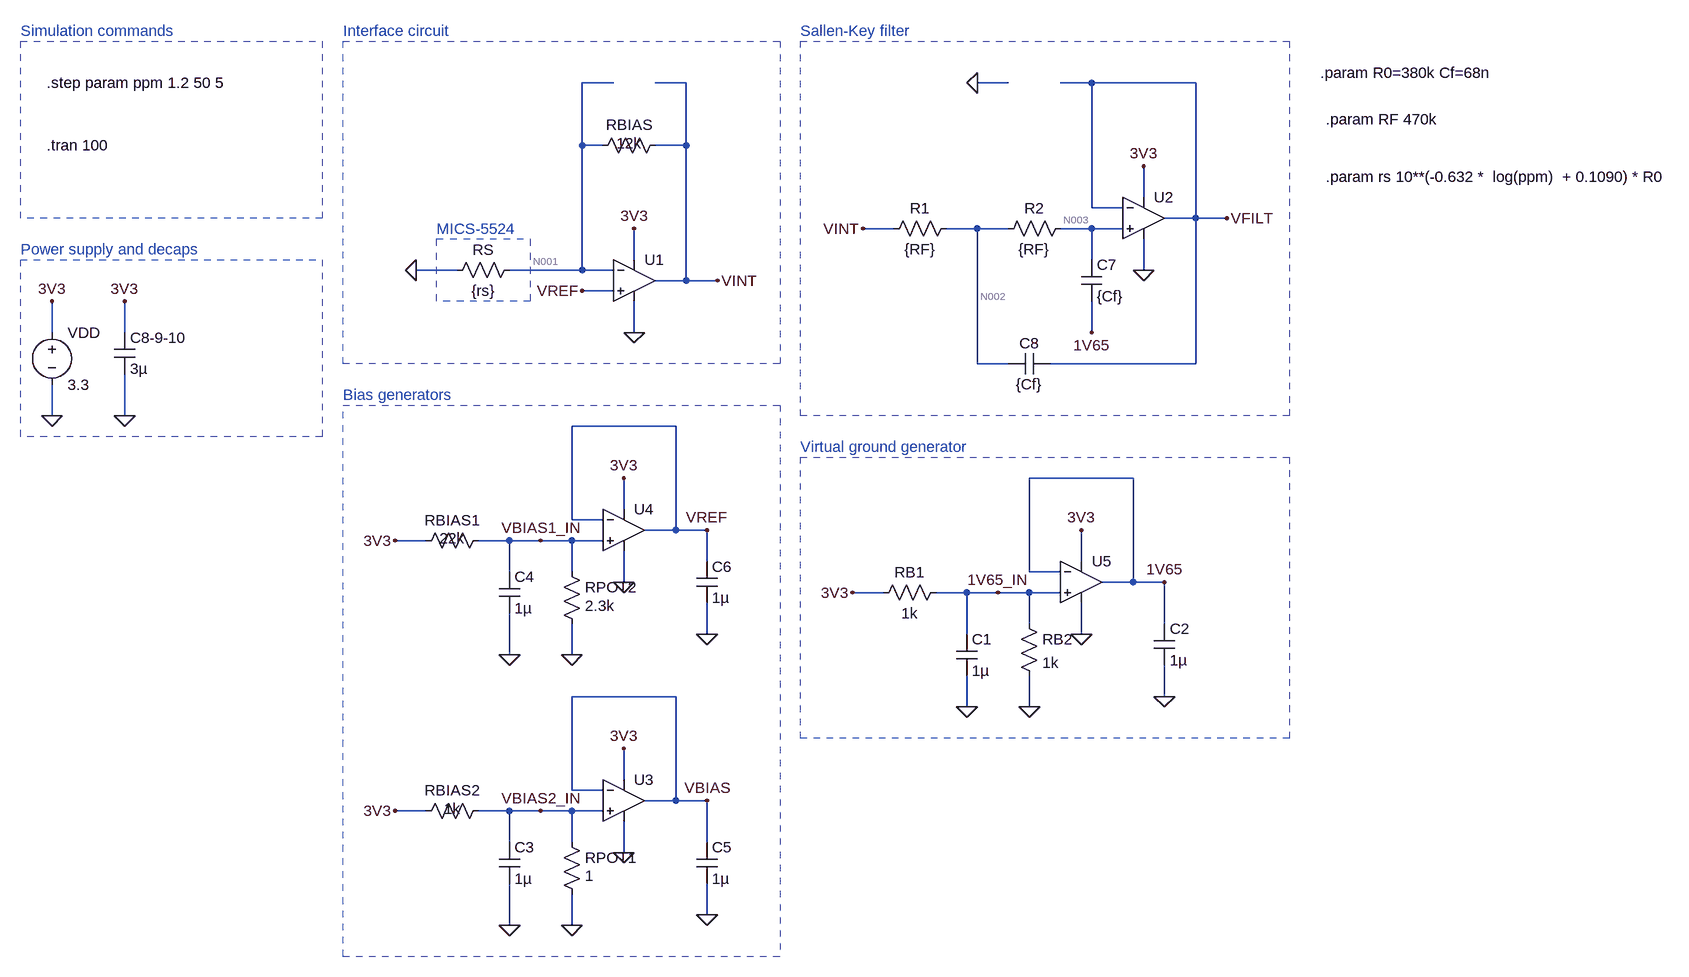
[diagram p0: schematic conditioning_chain_student.asc]
conditioning_chain_student.asc, the LTspice schematic file:
Version 4
SHEET 1 1052 1636
WIRE -832 -176 -880 -176
WIRE -720 -176 -768 -176
WIRE -224 -176 -272 -176
WIRE -96 -176 -144 -176
WIRE 64 -176 -96 -176
WIRE -880 -80 -880 -176
WIRE -848 -80 -880 -80
WIRE -720 -80 -720 -176
WIRE -720 -80 -768 -80
WIRE -16 0 -16 -48
WIRE -96 16 -96 -176
WIRE -48 16 -96 16
WIRE 64 32 64 -176
WIRE 64 32 16 32
WIRE 112 32 64 32
WIRE -400 48 -448 48
WIRE -272 48 -320 48
WIRE -224 48 -272 48
WIRE -96 48 -144 48
WIRE -48 48 -96 48
WIRE -800 96 -800 48
WIRE -96 96 -96 48
WIRE -1072 112 -1136 112
WIRE -880 112 -880 -80
WIRE -880 112 -992 112
WIRE -832 112 -880 112
WIRE -16 112 -16 64
WIRE -720 128 -720 -80
WIRE -720 128 -768 128
WIRE -672 128 -720 128
WIRE -832 144 -880 144
WIRE -1696 208 -1696 160
WIRE -1584 208 -1584 160
WIRE -800 208 -800 160
WIRE -96 208 -96 160
WIRE -272 256 -272 48
WIRE -224 256 -272 256
WIRE 64 256 64 32
WIRE 64 256 -160 256
WIRE -1696 336 -1696 288
WIRE -1584 336 -1584 272
WIRE -736 352 -896 352
WIRE -32 432 -192 432
WIRE -816 480 -816 432
WIRE -896 496 -896 352
WIRE -848 496 -896 496
WIRE -736 512 -736 352
WIRE -736 512 -784 512
WIRE -688 512 -736 512
WIRE -1120 528 -1168 528
WIRE -992 528 -1040 528
WIRE -944 528 -992 528
WIRE -896 528 -944 528
WIRE -848 528 -896 528
WIRE -688 560 -688 512
WIRE -112 560 -112 512
WIRE -992 576 -992 528
WIRE -896 576 -896 528
WIRE -192 576 -192 432
WIRE -144 576 -192 576
WIRE -816 592 -816 544
WIRE -32 592 -32 432
WIRE -32 592 -80 592
WIRE 16 592 -32 592
WIRE -416 608 -464 608
WIRE -288 608 -336 608
WIRE -240 608 -288 608
WIRE -192 608 -240 608
WIRE -144 608 -192 608
WIRE -192 656 -192 608
WIRE 16 656 16 592
WIRE -688 672 -688 624
WIRE -288 672 -288 608
WIRE -112 672 -112 624
WIRE -992 704 -992 640
WIRE -896 704 -896 656
WIRE -736 768 -896 768
WIRE 16 768 16 720
WIRE -288 784 -288 736
WIRE -192 784 -192 736
WIRE -816 896 -816 848
WIRE -896 912 -896 768
WIRE -848 912 -896 912
WIRE -736 928 -736 768
WIRE -736 928 -784 928
WIRE -688 928 -736 928
WIRE -1120 944 -1168 944
WIRE -992 944 -1040 944
WIRE -944 944 -992 944
WIRE -896 944 -944 944
WIRE -848 944 -896 944
WIRE -992 992 -992 944
WIRE -896 992 -896 944
WIRE -688 992 -688 928
WIRE -816 1008 -816 960
WIRE -688 1104 -688 1056
WIRE -992 1120 -992 1056
WIRE -896 1120 -896 1072
FLAG -112 672 0
FLAG -1696 336 0
FLAG -192 784 0
FLAG -1696 160 3V3
FLAG -112 512 3V3
FLAG -288 784 0
FLAG -240 608 1V65_IN
FLAG 16 592 1V65
FLAG -464 608 3V3
FLAG 16 768 0
FLAG -800 208 0
FLAG -800 48 3V3
FLAG -880 144 VREF
FLAG -672 128 VINT
FLAG -816 1008 0
FLAG -816 848 3V3
FLAG -688 928 VBIAS
FLAG -896 1120 0
FLAG -1168 944 3V3
FLAG -992 1120 0
FLAG -816 592 0
FLAG -816 432 3V3
FLAG -688 512 VREF
FLAG -896 704 0
FLAG -1168 528 3V3
FLAG -992 704 0
FLAG -16 112 0
FLAG -16 -48 3V3
FLAG -448 48 VINT
FLAG 112 32 VFILT
FLAG -688 1104 0
FLAG -688 672 0
FLAG -1584 336 0
FLAG -1584 160 3V3
FLAG -944 944 VBIAS2_IN
FLAG -944 528 VBIAS1_IN
FLAG -272 -176 0
FLAG -96 208 1V65
FLAG -1136 112 0
SYMBOL voltage -1696 192 R0
WINDOW 123 0 0 Left 0
WINDOW 39 24 124 Left 2
SYMATTR InstName VDD
SYMATTR Value 3.3
SYMBOL res -208 640 R0
SYMATTR InstName RB2
SYMATTR Value 1k
SYMBOL res -320 592 R90
WINDOW 0 0 56 VBottom 2
WINDOW 3 32 56 VTop 2
SYMATTR InstName RB1
SYMATTR Value 1k
SYMBOL cap -304 672 R0
SYMATTR InstName C1
SYMATTR Value 1µ
SYMBOL cap 0 656 R0
SYMATTR InstName C2
SYMATTR Value 1µ
SYMBOL res -752 -96 R90
WINDOW 0 0 56 VBottom 2
WINDOW 3 28 56 VBottom 2
SYMATTR InstName RBIAS
SYMATTR Value 12k
SYMBOL res -912 976 R0
WINDOW 3 36 68 Left 2
SYMATTR Value 1
SYMATTR InstName RPOT1
SYMBOL cap -1008 992 R0
SYMATTR InstName C3
SYMATTR Value 1µ
SYMBOL res -912 560 R0
WINDOW 3 36 68 Left 2
SYMATTR Value 2.3k
SYMATTR InstName RPOT2
SYMBOL res -1024 512 R90
WINDOW 0 0 56 VBottom 2
WINDOW 3 28 56 VBottom 2
SYMATTR InstName RBIAS1
SYMATTR Value 22k
SYMBOL cap -1008 576 R0
SYMATTR InstName C4
SYMATTR Value 1µ
SYMBOL cap -704 992 R0
SYMATTR InstName C5
SYMATTR Value 1µ
SYMBOL cap -704 560 R0
SYMATTR InstName C6
SYMATTR Value 1µ
SYMBOL cap -1600 208 R0
SYMATTR InstName C8-9-10
SYMATTR Value 3µ
SYMBOL Opamps\\UniversalOpamp2 -800 128 R0
SYMATTR InstName U1
SYMBOL Opamps\\UniversalOpamp2 -16 32 R0
SYMATTR InstName U2
SYMBOL Opamps\\UniversalOpamp2 -816 928 R0
SYMATTR InstName U3
SYMBOL Opamps\\UniversalOpamp2 -816 512 R0
SYMATTR InstName U4
SYMBOL Opamps\\UniversalOpamp2 -112 592 R0
SYMATTR InstName U5
SYMBOL res -976 96 R90
WINDOW 0 0 56 VBottom 2
WINDOW 3 32 56 VTop 2
SYMATTR InstName RS
SYMATTR Value {rs}
SYMBOL res -304 32 R90
WINDOW 0 0 56 VBottom 2
WINDOW 3 32 56 VTop 2
SYMATTR InstName R1
SYMATTR Value {RF}
SYMBOL res -128 32 R90
WINDOW 0 0 56 VBottom 2
WINDOW 3 32 56 VTop 2
SYMATTR InstName R2
SYMATTR Value {RF}
SYMBOL cap -112 96 R0
SYMATTR InstName C7
SYMATTR Value {Cf}
SYMBOL cap -160 240 R90
WINDOW 0 0 32 VBottom 2
WINDOW 3 32 32 VTop 2
SYMATTR InstName C8
SYMATTR Value {Cf}
SYMBOL res -1024 928 R90
WINDOW 0 0 56 VBottom 2
WINDOW 3 28 56 VBottom 2
SYMATTR InstName RBIAS2
SYMATTR Value 1k
TEXT -1744 -256 Left 2 ;Simulation commands
TEXT -1744 80 Left 2 ;Power supply and decaps
TEXT -1248 -256 Left 2 ;Interface circuit
TEXT -1248 304 Left 2 ;Bias generators
TEXT -544 -256 Left 2 ;Sallen-Key filter
TEXT -544 384 Left 2 ;Virtual ground generator
TEXT -1104 48 Left 2 ;MICS-5524
TEXT 256 -192 Left 2 !.param R0=380k Cf=68n
TEXT -1704 -80 Left 2 !.tran 100
TEXT -1704 -176 Left 2 !.step param ppm 1.2 50 5
TEXT 264 -120 Left 2 !.param RF 470k
TEXT 264 -32 Left 2 !.param rs 10**(-0.632 *  log(ppm)  + 0.1090) * R0
RECTANGLE Normal -1280 368 -1744 96 2
RECTANGLE Normal -576 1168 -1248 320 2
RECTANGLE Normal 208 336 -544 -240 2
RECTANGLE Normal 208 832 -544 400 2
RECTANGLE Normal -576 256 -1248 -240 2
RECTANGLE Normal -1280 32 -1744 -240 2
RECTANGLE Normal -960 160 -1104 64 2

The netlist it stands for:
* conditioning_chain_student.asc
VDD 3V3 0 3.3
RB2 1V65_IN 0 1k
RB1 1V65_IN 3V3 1k
C1 1V65_IN 0 1µ
C2 1V65 0 1µ
RBIAS VINT N001 12k
RPOT1 VBIAS2_IN 0 1
C3 VBIAS2_IN 0 1µ
RPOT2 VBIAS1_IN 0 2.3k
RBIAS1 VBIAS1_IN 3V3 22k
C4 VBIAS1_IN 0 1µ
C5 VBIAS 0 1µ
C6 VREF 0 1µ
C8-9-10 3V3 0 3µ
XU1 VREF N001 3V3 0 VINT level.2 Avol=1Meg GBW=10Meg Slew=10Meg ilimit=25m rail=0 Vos=0 phimargin=45 en=0 enk=0 in=0 ink=0 Rin=500Meg  ; pins IN+ IN- V+ V- OUT
XU2 N003 VFILT 3V3 0 VFILT level.2 Avol=1Meg GBW=10Meg Slew=10Meg ilimit=25m rail=0 Vos=0 phimargin=45 en=0 enk=0 in=0 ink=0 Rin=500Meg  ; pins IN+ IN- V+ V- OUT
XU3 VBIAS2_IN VBIAS 3V3 0 VBIAS level.2 Avol=1Meg GBW=10Meg Slew=10Meg ilimit=25m rail=0 Vos=0 phimargin=45 en=0 enk=0 in=0 ink=0 Rin=500Meg  ; pins IN+ IN- V+ V- OUT
XU4 VBIAS1_IN VREF 3V3 0 VREF level.2 Avol=1Meg GBW=10Meg Slew=10Meg ilimit=25m rail=0 Vos=0 phimargin=45 en=0 enk=0 in=0 ink=0 Rin=500Meg  ; pins IN+ IN- V+ V- OUT
XU5 1V65_IN 1V65 3V3 0 1V65 level.2 Avol=1Meg GBW=10Meg Slew=10Meg ilimit=25m rail=0 Vos=0 phimargin=45 en=0 enk=0 in=0 ink=0 Rin=500Meg  ; pins IN+ IN- V+ V- OUT
RS N001 0 {rs}
R1 N002 VINT {RF}
R2 N003 N002 {RF}
C7 N003 1V65 {Cf}
C8 VFILT N002 {Cf}
RBIAS2 VBIAS2_IN 3V3 1k
* Simulation commands
* Power supply and decaps
* Interface circuit
* Bias generators
* Sallen-Key filter
* Virtual ground generator
* MICS-5524
.param R0=380k Cf=68n
.tran 100
.step param ppm 1.2 50 5
.param RF 470k
.param rs 10**(-0.632 *  log(ppm)  + 0.1090) * R0
.lib UniversalOpamps2.sub
.backanno
.end

* Results of the author's LTspice run, read from the files saved beside the schematic
* Operating Point (first step), zero values left out:
*   ppm = 1.2 
*   V(3v3) = 3.3 V
*   V(1v65_in) = 1.65 V
*   V(1v65) = 1.65 V
*   V(vint) = 322.3 mV
*   V(n001) = 312.4 mV
*   V(vbias2_in) = 3.297 mV
*   V(vbias1_in) = 312.4 mV
*   V(vbias) = 3.308 mV
*   V(vref) = 312.4 mV
*   V(vfilt) = 324.8 mV
*   V(n003) = 324.8 mV
*   V(n002) = 323.6 mV
*   I(Rb2) = 1.65 mA
*   I(Rb1) = -1.65 mA
*   I(Rbias) = 831.2 nA
*   I(Rpot1) = 3.297 mA
*   I(Rpot2) = 135.8 µA
*   I(Rbias1) = -135.8 µA
*   I(Rs) = 833.9 nA
*   I(R1) = 2.65 nA
*   I(R2) = 2.65 nA
*   I(Rbias2) = -3.297 mA
*   I(Vdd) = -5.551 mA
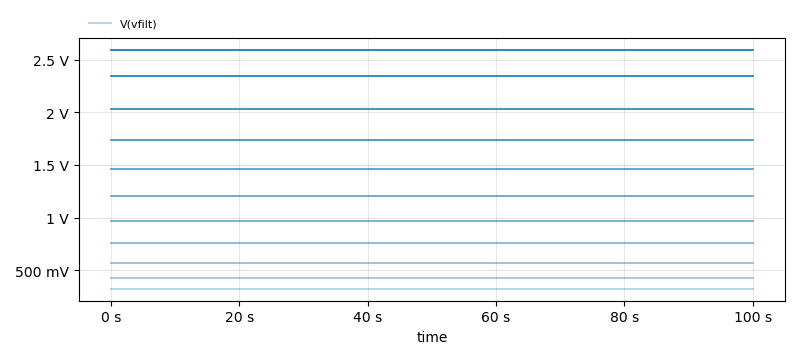
[diagram p1: Transient Analysis of conditioning_chain_student.asc, plotted from the saved traces]
* Transient Analysis, 11 runs:
*   V(vfilt) [ppm=1.2]: min 324.8 mV, max 324.8 mV, average 324.8 mV, rms 324.8 mV, last 324.8 mV
*   V(vfilt) [ppm=6.2]: min 423.8 mV, max 423.8 mV, average 423.8 mV, rms 423.8 mV, last 423.8 mV
*   V(vfilt) [ppm=11.2]: min 572.5 mV, max 572.5 mV, average 572.5 mV, rms 572.5 mV, last 572.5 mV
*   V(vfilt) [ppm=16.2]: min 755.7 mV, max 755.7 mV, average 755.7 mV, rms 755.7 mV, last 755.7 mV
*   V(vfilt) [ppm=21.2]: min 967 mV, max 967 mV, average 967 mV, rms 967 mV, last 967 mV
*   V(vfilt) [ppm=26.2]: min 1.202 V, max 1.202 V, average 1.202 V, rms 1.202 V, last 1.202 V
*   V(vfilt) [ppm=31.2]: min 1.459 V, max 1.459 V, average 1.459 V, rms 1.459 V, last 1.459 V
*   V(vfilt) [ppm=36.2]: min 1.736 V, max 1.736 V, average 1.736 V, rms 1.736 V, last 1.736 V